# EAGLE design leistungsmesser 4fach (EAGLE 7.4.0)
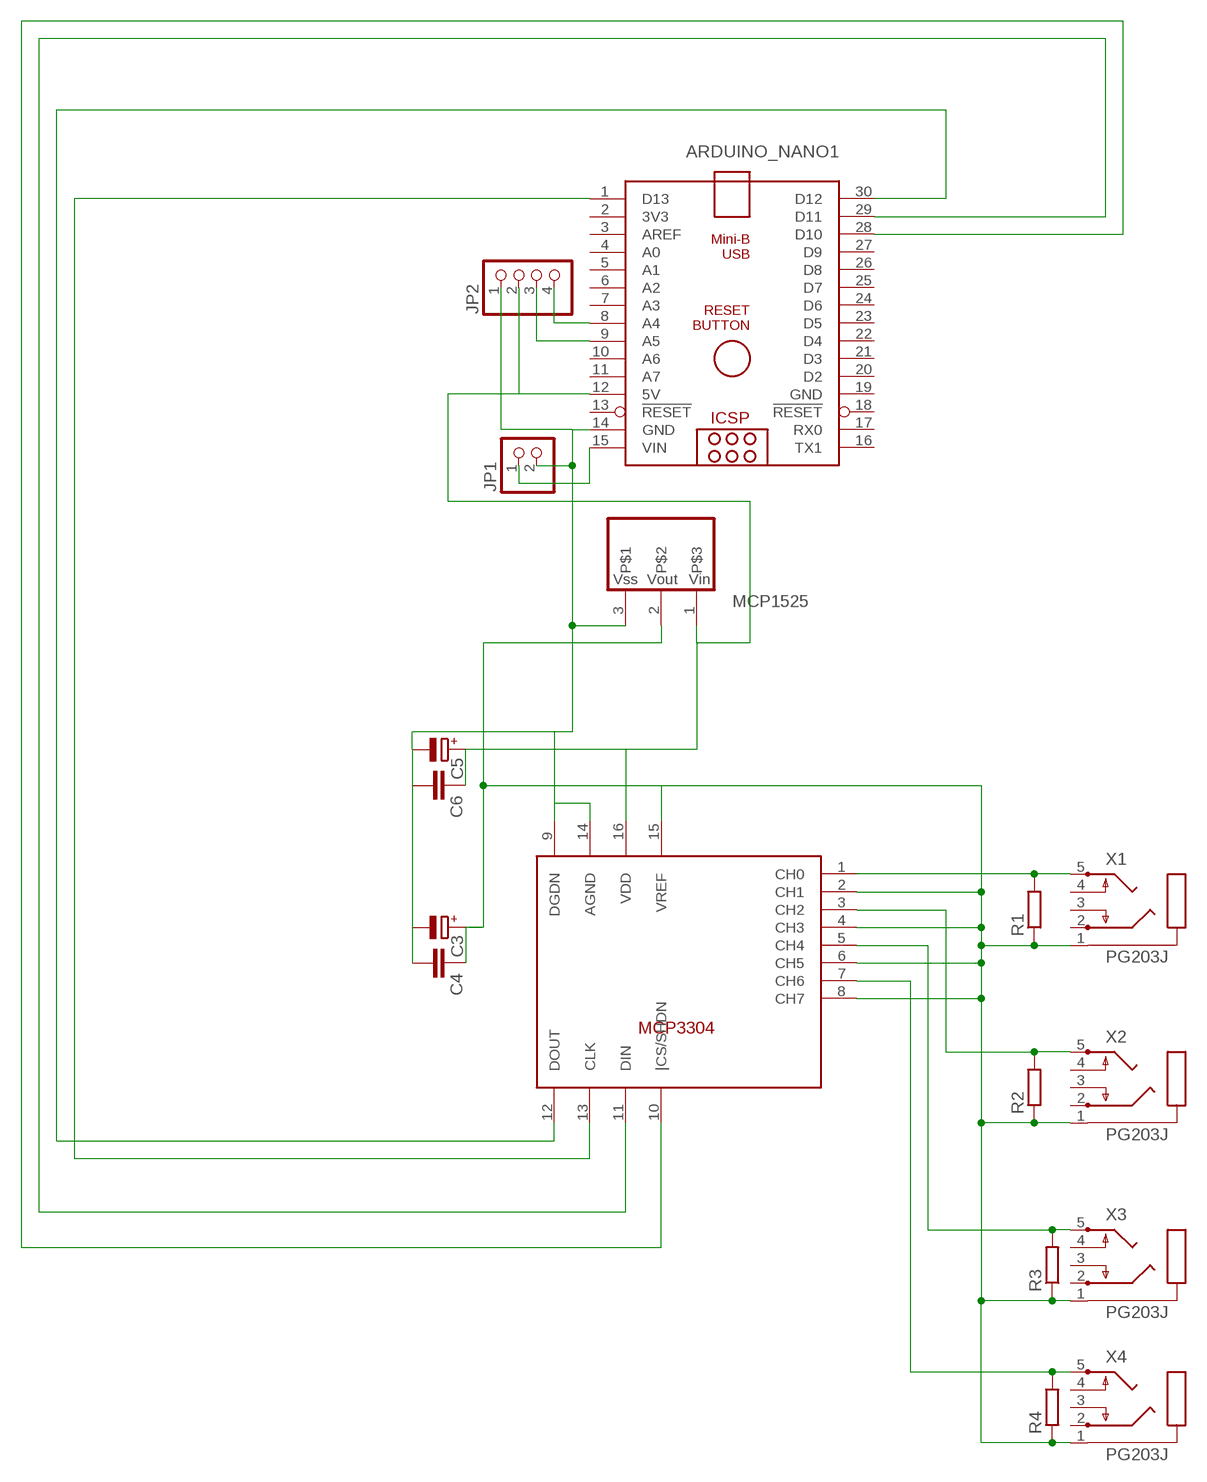
[diagram p0: schematic, sheet 1]

## Parts
ARDUINO_NANO1  ARDUINO_NANO  [ARDUINO_NANO]
C3  CPOL-EUE2,5-6E  [E2,5-6E]
C4  C-EU025-024X044  [C025-024X044]
C5  CPOL-EUE2,5-6E  [E2,5-6E]
C6  C-EU025-024X044  [C025-024X044]
IC4  MCP1525  [TO92-]
JP1  PINHD-1X2  [1X02]
JP2  PINHD-1X4  [1X04]
R1  R-EU_0309/V  [0309V]
R2  R-EU_0309/V  [0309V]
R3  R-EU_0309/V  [0309V]
R4  R-EU_0309/V  [0309V]
U$1  MCP3304  [DIP16]
X1  PG203J  [PG203J]
X2  PG203J  [PG203J]
X3  PG203J  [PG203J]
X4  PG203J  [PG203J]

## Nets
N$1: ARDUINO_NANO1.14(GND) C3.- C4.2 C5.- C6.2 IC4.3 JP1.2 JP2.1 U$1.9(DGDN) U$1.14(AGND)
N$2: C3.+ C4.1 IC4.2 R1.1 R2.1 R3.1 R4.1 U$1.2(CH1) U$1.4(CH3) U$1.6(CH5) U$1.8(CH7) U$1.15(VREF) X1.1 X2.1 X3.1 X4.1
N$3: R2.2 U$1.3(CH2) X2.5
N$4: ARDUINO_NANO1.30(D12) U$1.12(DOUT)
N$5: ARDUINO_NANO1.15(VIN) JP1.1
N$6: ARDUINO_NANO1.28(D10) U$1.10(|CS/SHDN)
N$7: ARDUINO_NANO1.29(D11) U$1.11(DIN)
N$8: ARDUINO_NANO1.1(D13) U$1.13(CLK)
N$9: R3.2 U$1.5(CH4) X3.5
N$10: ARDUINO_NANO1.12(5V) C5.+ C6.1 IC4.1 JP2.2 U$1.16(VDD)
N$11: R1.2 U$1.1(CH0) X1.5
N$13: R4.2 U$1.7(CH6) X4.5
N$15: ARDUINO_NANO1.8(A4) JP2.4
N$16: ARDUINO_NANO1.9(A5) JP2.3
Unconnected: ARDUINO_NANO1.2(3V3) ARDUINO_NANO1.3(AREF) ARDUINO_NANO1.4(A0) ARDUINO_NANO1.5(A1) ARDUINO_NANO1.6(A2) ARDUINO_NANO1.7(A3) ARDUINO_NANO1.10(A6) ARDUINO_NANO1.11(A7) ARDUINO_NANO1.13(!RESET) ARDUINO_NANO1.16(TX1) ARDUINO_NANO1.17(RX0) ARDUINO_NANO1.18(!RESET) ARDUINO_NANO1.20(D2) ARDUINO_NANO1.21(D3) ARDUINO_NANO1.22(D4) ARDUINO_NANO1.23(D5) ARDUINO_NANO1.24(D6) ARDUINO_NANO1.25(D7) ARDUINO_NANO1.26(D8) ARDUINO_NANO1.27(D9) X1.2 X1.3 X1.4 X2.2 X2.3 X2.4 X3.2 X3.3 X3.4 X4.2 X4.3 X4.4

## Power pins joined to a net without a drawn wire
GND: ARDUINO_NANO1.19(GND)

## Library data of the parts
ARDUINO_NANO1 = ArduinoNanoV30:ARDUINO_NANO: Arduino Nano V3.0 Overview: The Arduino Nano is a small, complete, and breadboard-friendly board based on the ATmega328 (Arduino Nano 3.x) or ATmega168 (Arduino Nano 2.x). It has more or less the same functionality of the Arduino Duemilanove, but in a different package. It lacks only a DC power jack, and works with a Mini-B USB cable instead of a standard one. The Nano was designed and is being produced by Gravitech. Specifications: Microcontroller Atmel ATmega168 or ATmega328 Operating Voltage (logic level) 5 V Input Voltage (recommended) 7-12 V Input Voltage (limits) 6-20 V Digital I/O Pins 14 (of which 6 provide PWM output) Analog Input Pins 8 DC Current per I/O Pin 40 mA Flash Memory 16 KB (ATmega168) or 32 KB (ATmega328) of which 2 KB used by bootloader SRAM 1 KB (ATmega168) or 2 KB (ATmega328) EEPROM 512 bytes (ATmega168) or 1 KB (ATmega328) Clock Speed 16 MHz Dimensions 0.73" x 1.70" Length 45 mm Width 18 mm Weigth 5 g Power: The Arduino Nano can be powered via the Mini-B USB connection, 6-20V unregulated external power supply (pin 30), or 5V regulated external power supply (pin 27). The power source is automatically selected to the highest voltage source. Memory: The ATmega168 has 16 KB of flash memory for storing code (of which 2 KB is used for the bootloader); the ATmega328 has 32 KB, (also with 2 KB used for the bootloader). The ATmega168 has 1 KB of SRAM and 512 bytes of EEPROM (which can be read and written with the EEPROM library); the ATmega328 has 2 KB of SRAM and 1 KB of EEPROM. Input and Output: Each of the 14 digital pins on the Nano can be used as an input or output, using pinMode(), digitalWrite(), and digitalRead() functions. They operate at 5 volts. Each pin can provide or receive a maximum of 40 mA and has an internal pull-up resistor (disconnected by default) of 20-50 kOhms. In addition, some pins have specialized functions. Visit Arduino - ArduinoBoardNano <https://www.arduino.cc/en/Main/ArduinoBoardNano>
C3 C5 = rcl:CPOL-EU: POLARIZED CAPACITOR, European symbol
C4 C6 = rcl:C-EU: CAPACITOR, European symbol
IC4 = v-reg:MCP1525: VOLTAGE REGULATOR
JP1 = pinhead:PINHD-1X2: PIN HEADER
JP2 = pinhead:PINHD-1X4: PIN HEADER
R1-R4 = resistor:R-EU_: RESISTOR, European symbol
U$1 = mcp3304:MCP3304: 8 channel ADC converter with SPI interface
X1-X4 = con-hirschmann:PG203J: MIC/HEADPHONE JACK KS-S stereo microphone/headphone jack PG203JN (Schukat); OC_FARNELL: unknown; OC_NEWARK: unknown

## Board
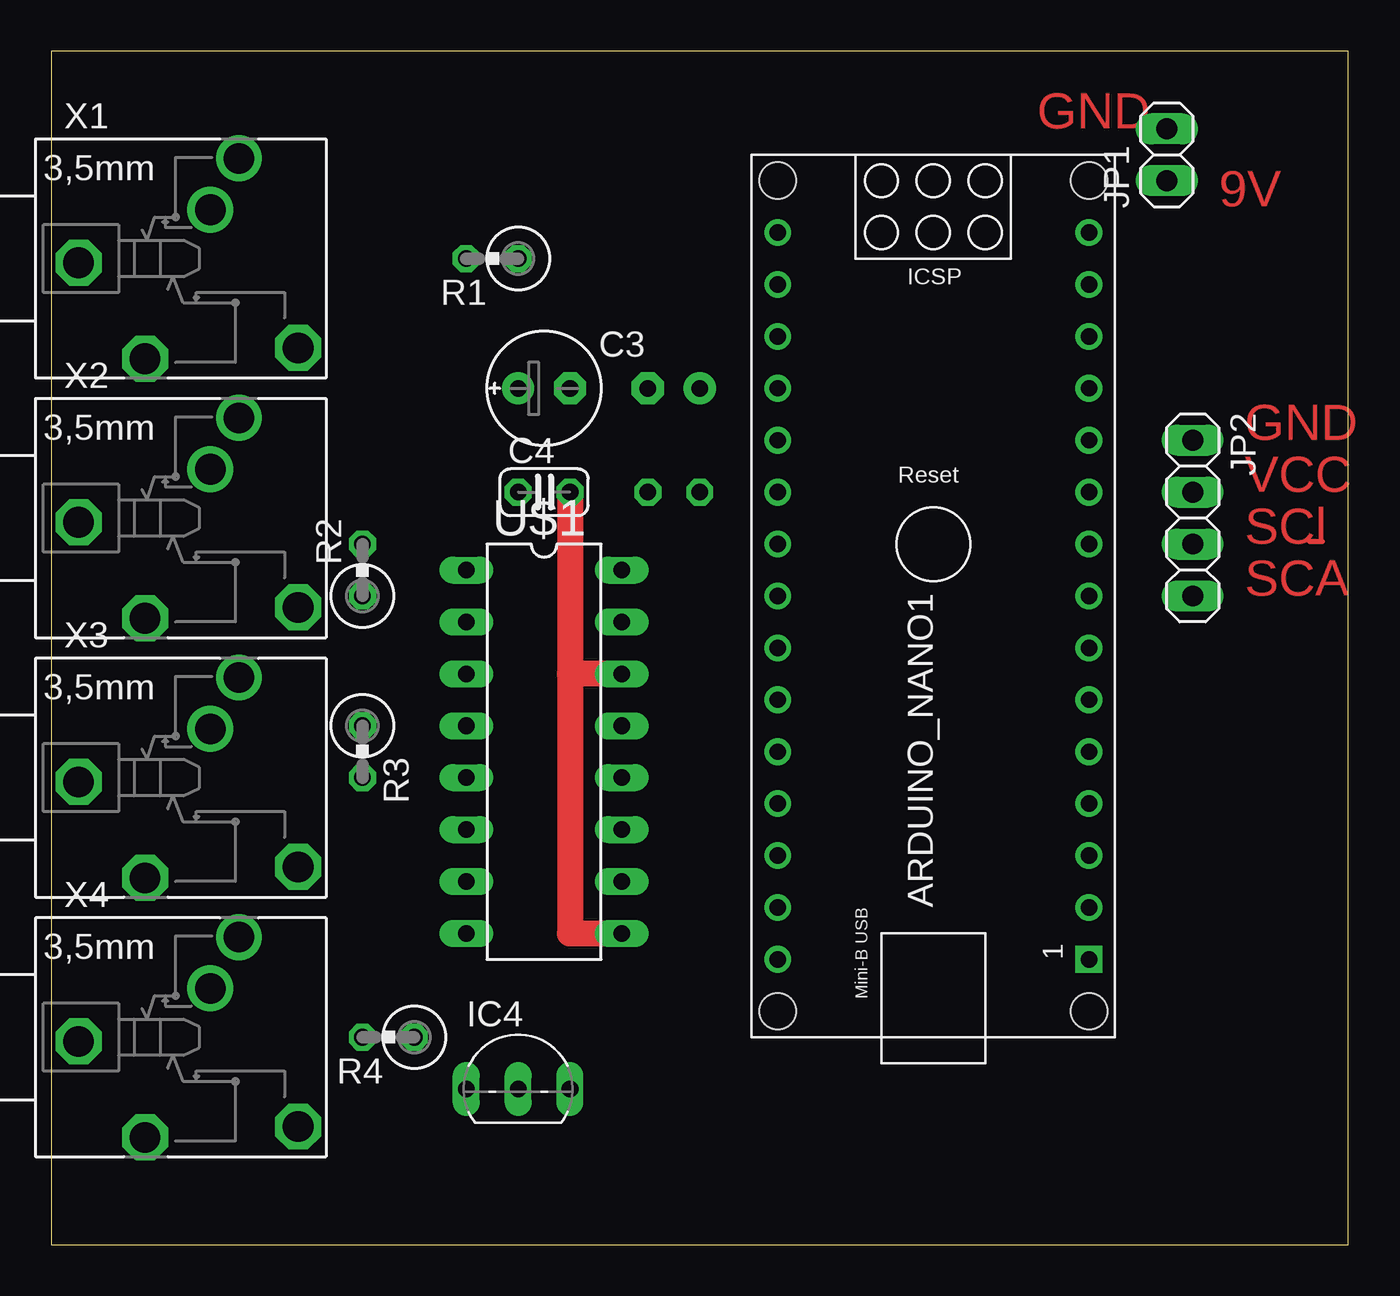
[diagram p1: board, top side]
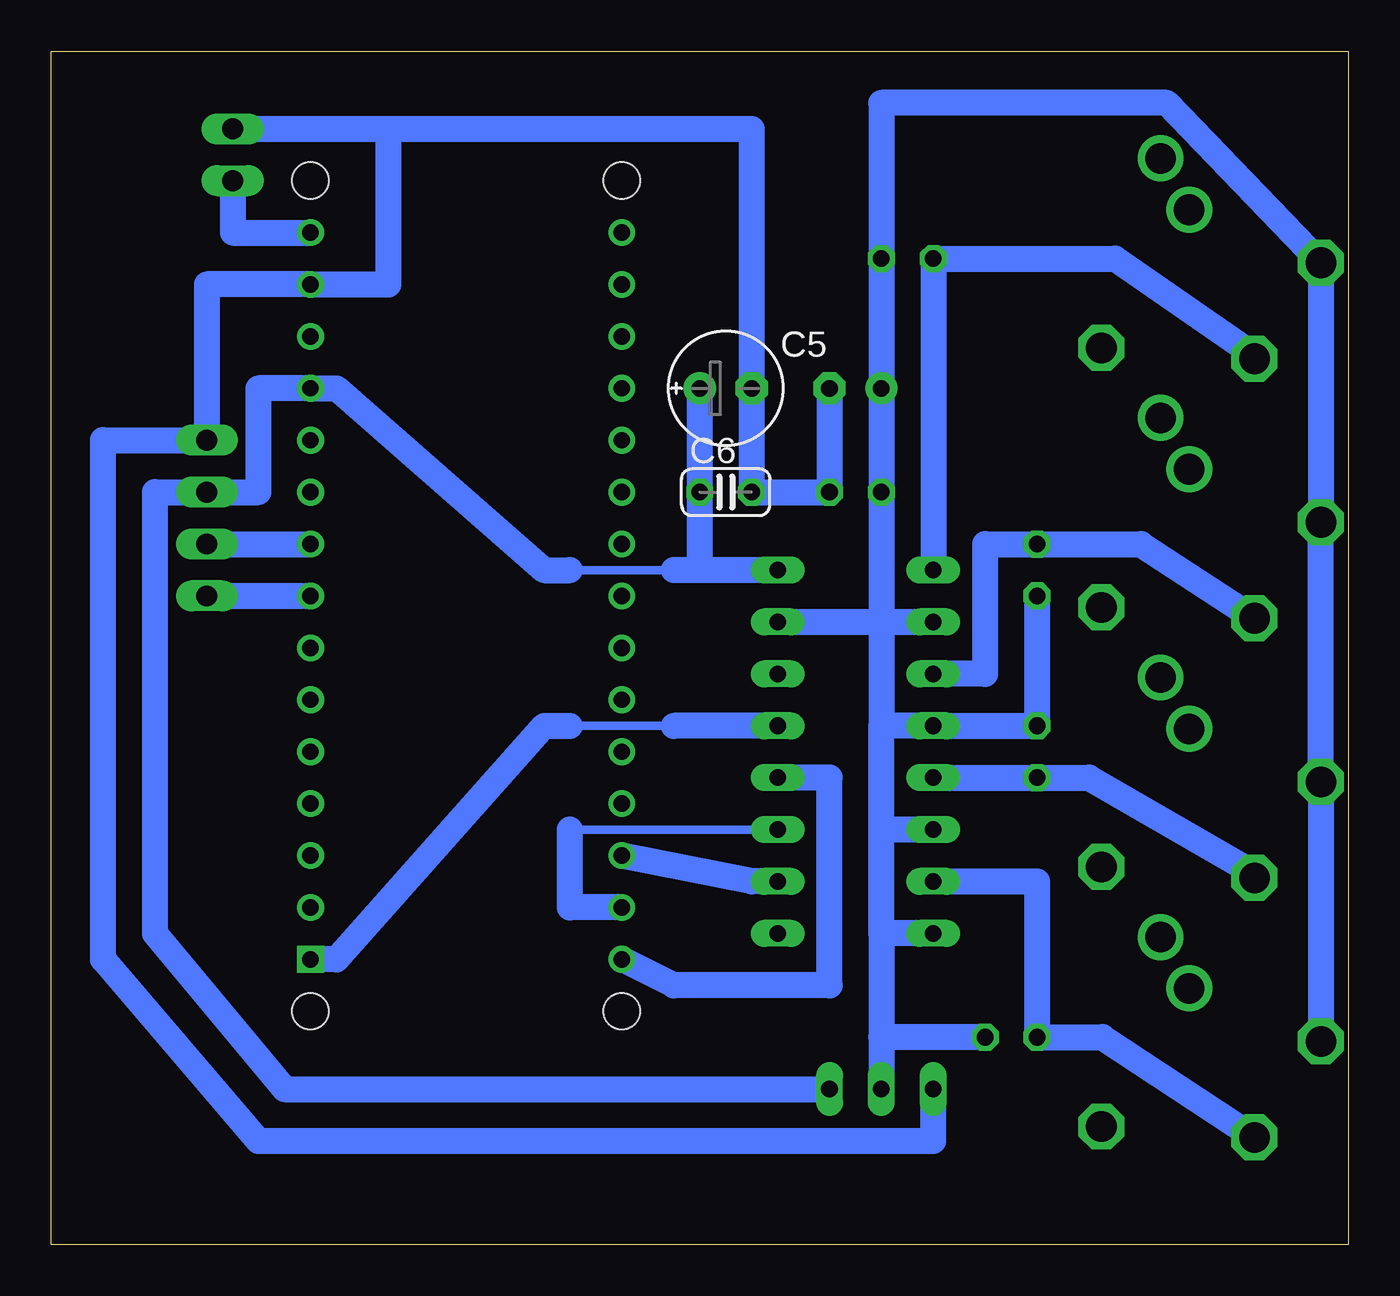
[diagram p2: board, bottom side, seen from below]

Size 63.5 x 58.41 mm. Coordinates in mm from the lower left corner, seen from the top.
Outline: 0,0 63.5,0 63.5,58.41 0,58.41 0,0
Copper layers (1*16): Top 0.035mm / dielectric 1.5mm / Bottom 0.035mm
Design rules "default *": minimum track width 50mil, minimum drill 24mil, track to track 8mil, track to pad 8mil, pad to pad 8mil, via to via 8mil, smd to smd 8mil, copper to edge 40mil, drill to drill 8mil, minimum pad ring 10mil, minimum via ring 8mil, stop-mask expansion 4mil, vias tented up to drill 0mil, thermal gap 10mil

### Footprints (pad centres in the part's own frame; a part is rotated, then mirrored left to right if it is on the bottom)
ARDUINO_NANO = drill 0.8 square: 1 -20.32,-7.62 | drill 0.8: 2 -17.78,-7.62; 3 -15.24,-7.62; 4 -12.7,-7.62; 5 -10.16,-7.62; 6 -7.62,-7.62; 7 -5.08,-7.62; 8 -2.54,-7.62; 9 0,-7.62; 10 2.54,-7.62; 11 5.08,-7.62; 12 7.62,-7.62; 13 10.16,-7.62; 14 12.7,-7.62; 15 15.24,-7.62; 16 15.24,7.62; 17 12.7,7.62; 18 10.16,7.62; 19 7.62,7.62; 20 5.08,7.62; 21 2.54,7.62; 22 0,7.62; 23 -2.54,7.62; 24 -5.08,7.62; 25 -7.62,7.62; 26 -10.16,7.62; 27 -12.7,7.62; 28 -15.24,7.62; 29 -17.78,7.62; 30 -20.32,7.62 | hole 1.778: -22.86,-7.62; -22.86,7.62; 17.78,7.62; 17.78,-7.62
E2,5-6E = drill 0.813 pad 1.575: + -1.27,0 | drill 0.813 pad 1.575 octagon: - 1.27,0
C025-024X044 = drill 0.813 octagon: 1 -1.27,0; 2 1.27,0
TO92- = drill 0.813 long: 1 2.54,0; 2 0,0; 3 -2.54,0
1X02 = drill 1.016 long: 1 -1.27,0; 2 1.27,0
1X04 = drill 1.016 long: 1 -3.81,0; 2 -1.27,0; 3 1.27,0; 4 3.81,0
0309V = drill 0.813 octagon: 1 -1.27,0; 2 1.27,0
DIP16 = drill 0.813 long: 1 -7.62,-3.81; 2 -5.08,-3.81; 3 -2.54,-3.81; 4 0,-3.81; 5 2.54,-3.81; 6 5.08,-3.81; 7 7.62,-3.81; 8 10.16,-3.81; 9 10.16,3.81; 10 7.62,3.81; 11 5.08,3.81; 12 2.54,3.81; 13 0,3.81; 14 -2.54,3.81; 15 -5.08,3.81; 16 -7.62,3.81
PG203J = drill 1.499 octagon: 1 -5.004,-0.203; 4 5.74,-4.369; 5 -1.753,-4.902 | drill 1.499: 2 2.845,4.902; 3 1.448,2.388

### Placement (x,y rotation side)
ARDUINO_NANO1  43.18,34.29 90 top
C3  24.13,41.91 0 top
C4  24.13,36.83 0 top
C5  30.48,41.91 0 bottom
C6  30.48,36.83 0 bottom
IC4  22.86,7.62 0 top
JP1  54.61,53.34 90 top
JP2  55.88,35.56 270 top
R1  21.59,48.26 180 top
R2  15.24,33.02 90 top
R3  15.24,24.13 270 top
R4  16.51,10.16 180 top
U$1  24.13,25.4 270 top
X1  6.35,48.26 0 top
X2  6.35,35.56 0 top
X3  6.35,22.86 0 top
X4  6.35,10.16 0 top

### Tracks (layer width: path | path; a pad name or v marks a point on that pad's centre or on a via)
N$1
  Top 1.27: U$1.14 25.4,27.94 | 25.4,27.94 25.4,15.24 U$1.9 | C4.2 25.4,27.94
  Bottom 1.27: C3.- C4.2 C6.2 C5.- 29.21,54.61 46.99,54.61 | JP1.2 46.99,54.61 | IC4.3 20.32,5.08 53.34,5.08 60.96,13.97 60.96,39.37 JP2.1 55.88,46.99 ARDUINO_NANO1.14 46.99,46.99 46.99,54.61
N$2
  Bottom 1.27: U$1.15 22.86,30.48 | 22.86,30.48 U$1.2 | U$1.8 22.86,15.24 | 22.86,25.4 U$1.4 R3.1 R2.1 | 22.86,30.48 22.86,25.4 | 22.86,15.24 22.86,20.32 | 22.86,20.32 22.86,25.4 | U$1.6 22.86,20.32 | 22.86,15.24 22.86,10.16 | 22.86,10.16 IC4.2 | 22.86,30.48 C4.1 C3.+ R1.1 22.86,55.88 8.89,55.88 X1.1 X2.1 X3.1 X4.1 | R4.1 22.86,10.16
N$3
  Bottom 1.27: U$1.3 17.78,27.94 17.78,34.29 R2.2 10.16,34.29 X2.5
N$4
  Bottom 1.27: U$1.12 25.4,22.86 25.4,12.7 33.02,12.7 ARDUINO_NANO1.30
N$5
  Bottom 1.27: JP1.1 54.61,49.53 ARDUINO_NANO1.15
N$6
  Bottom 1.27: U$1.10 29.21,17.78 ARDUINO_NANO1.28
N$7
  Bottom 0.406: 38.1,20.32 U$1.11
  Bottom 1.27: ARDUINO_NANO1.29 38.1,16.51 38.1,20.32
N$8
  Bottom 0.406: 33.02,25.4 38.1,25.4
  Bottom 1.27: ARDUINO_NANO1.1 49.53,13.97 39.37,25.4 38.1,25.4 | U$1.13 33.02,25.4
N$9
  Bottom 1.27: U$1.5 R3.2 12.7,22.86 5.08,18.44 X3.5
N$10
  Bottom 0.406: 33.02,33.02 38.1,33.02
  Bottom 1.27: C5.+ C6.1 31.75,33.02 | U$1.16 31.75,33.02 | IC4.1 52.07,7.62 58.42,15.24 58.42,36.83 JP2.2 53.34,36.83 53.34,41.91 ARDUINO_NANO1.12 49.53,41.91 39.37,33.02 38.1,33.02 | 31.75,33.02 33.02,33.02
N$11
  Bottom 1.27: X1.5 5.08,43.84 11.43,48.26 R1.2 U$1.1
N$12
  Top 0.254: 61.59,34.42 62.23,34.42
N$13
  Bottom 1.27: U$1.7 15.24,17.78 R4.2 12.04,10.16 X4.5
N$15
  Bottom 1.27: JP2.4 ARDUINO_NANO1.8
N$16
  Bottom 1.27: JP2.3 ARDUINO_NANO1.9

### Text on the board
Top: GND | 9V | GND | VCC | SCl | SCA